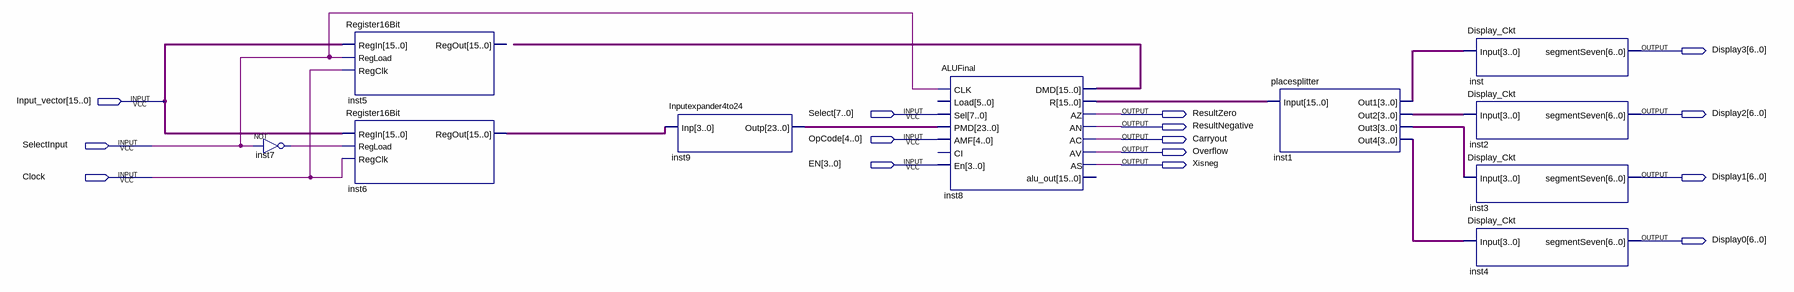
[diagram p0: schematic sheet]
// Quartus schematic FullALU.bdf as structural Verilog: 10 symbols, 15 pins
module FullALU (
  input  [15:0] Input_vector,
  input  [7:0] Select,
  input  [4:0] OpCode,
  input  SelectInput,
  input  [3:0] EN,
  input  Clock,
  output [6:0] Display3,
  output ResultZero,
  output [6:0] Display2,
  output ResultNegative,
  output Carryout,
  output Overflow,
  output Xisneg,
  output [6:0] Display1,
  output [6:0] Display0
);

  wire inst7_out;
  wire [3:0] inst1_out1, inst1_out2, inst1_out3, inst1_out4;
  wire [15:0] inst6_regout, inst8_dmd, inst8_r;
  wire [23:0] inst9_outp;

  not inst7 (inst7_out, SelectInput);
  Register16Bit inst5 (.RegIn(Input_vector), .RegLoad(SelectInput), .RegClk(Clock));  // open: RegOut
  Register16Bit inst6 (.RegIn(Input_vector), .RegLoad(inst7_out), .RegClk(Clock), .RegOut(inst6_regout));
  Inputexpander4to24 inst9 (.Inp(inst6_regout), .Outp(inst9_outp));
  ALUFinal inst8 (
    .CLK(SelectInput), .Sel(Select), .PMD(inst9_outp), .AMF(OpCode), .En(EN), .AZ(ResultZero),
    .AN(ResultNegative), .AC(Carryout), .AV(Overflow), .AS(Xisneg), .DMD(inst8_dmd), .R(inst8_r));  // open: Load, CI, alu_out
  placesplitter inst1 (.Input(inst8_r), .Out1(inst1_out1), .Out2(inst1_out2), .Out3(inst1_out3), .Out4(inst1_out4));
  Display_Ckt inst (.Input(inst1_out1), .segmentSeven(Display3));
  Display_Ckt inst2 (.Input(inst1_out2), .segmentSeven(Display2));
  Display_Ckt inst3 (.Input(inst1_out3), .segmentSeven(Display1));
  Display_Ckt inst4 (.Input(inst1_out4), .segmentSeven(Display0));
endmodule
